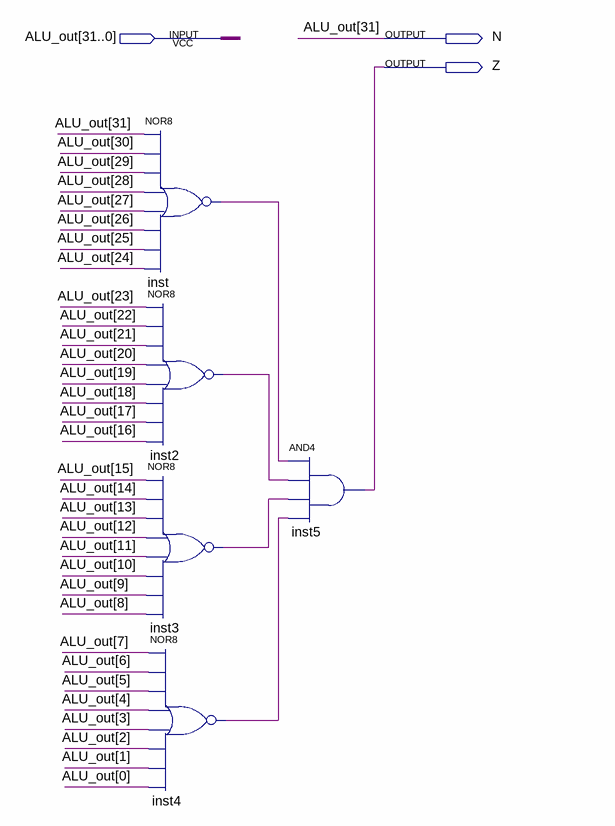
[diagram p0: schematic sheet]
// Quartus schematic NZ.bdf as structural Verilog: 5 symbols, 3 pins
module NZ (
  input  [31:0] ALU_out,
  output N,
  output Z
);

  wire inst2_out, inst3_out, inst4_out, inst_out;

  nor inst (inst_out, ALU_out[31], ALU_out[30], ALU_out[29], ALU_out[28], ALU_out[27], ALU_out[26], ALU_out[25], ALU_out[24]);
  nor inst2 (inst2_out, ALU_out[23], ALU_out[22], ALU_out[21], ALU_out[20], ALU_out[19], ALU_out[18], ALU_out[17], ALU_out[16]);
  nor inst3 (inst3_out, ALU_out[15], ALU_out[14], ALU_out[13], ALU_out[12], ALU_out[11], ALU_out[10], ALU_out[9], ALU_out[8]);
  nor inst4 (inst4_out, ALU_out[7], ALU_out[6], ALU_out[5], ALU_out[4], ALU_out[3], ALU_out[2], ALU_out[1], ALU_out[0]);
  and inst5 (Z, inst_out, inst2_out, inst3_out, inst4_out);

  assign N = ALU_out[31];
endmodule
